# Altium project УШЯИ.467444.130.PrjPcb
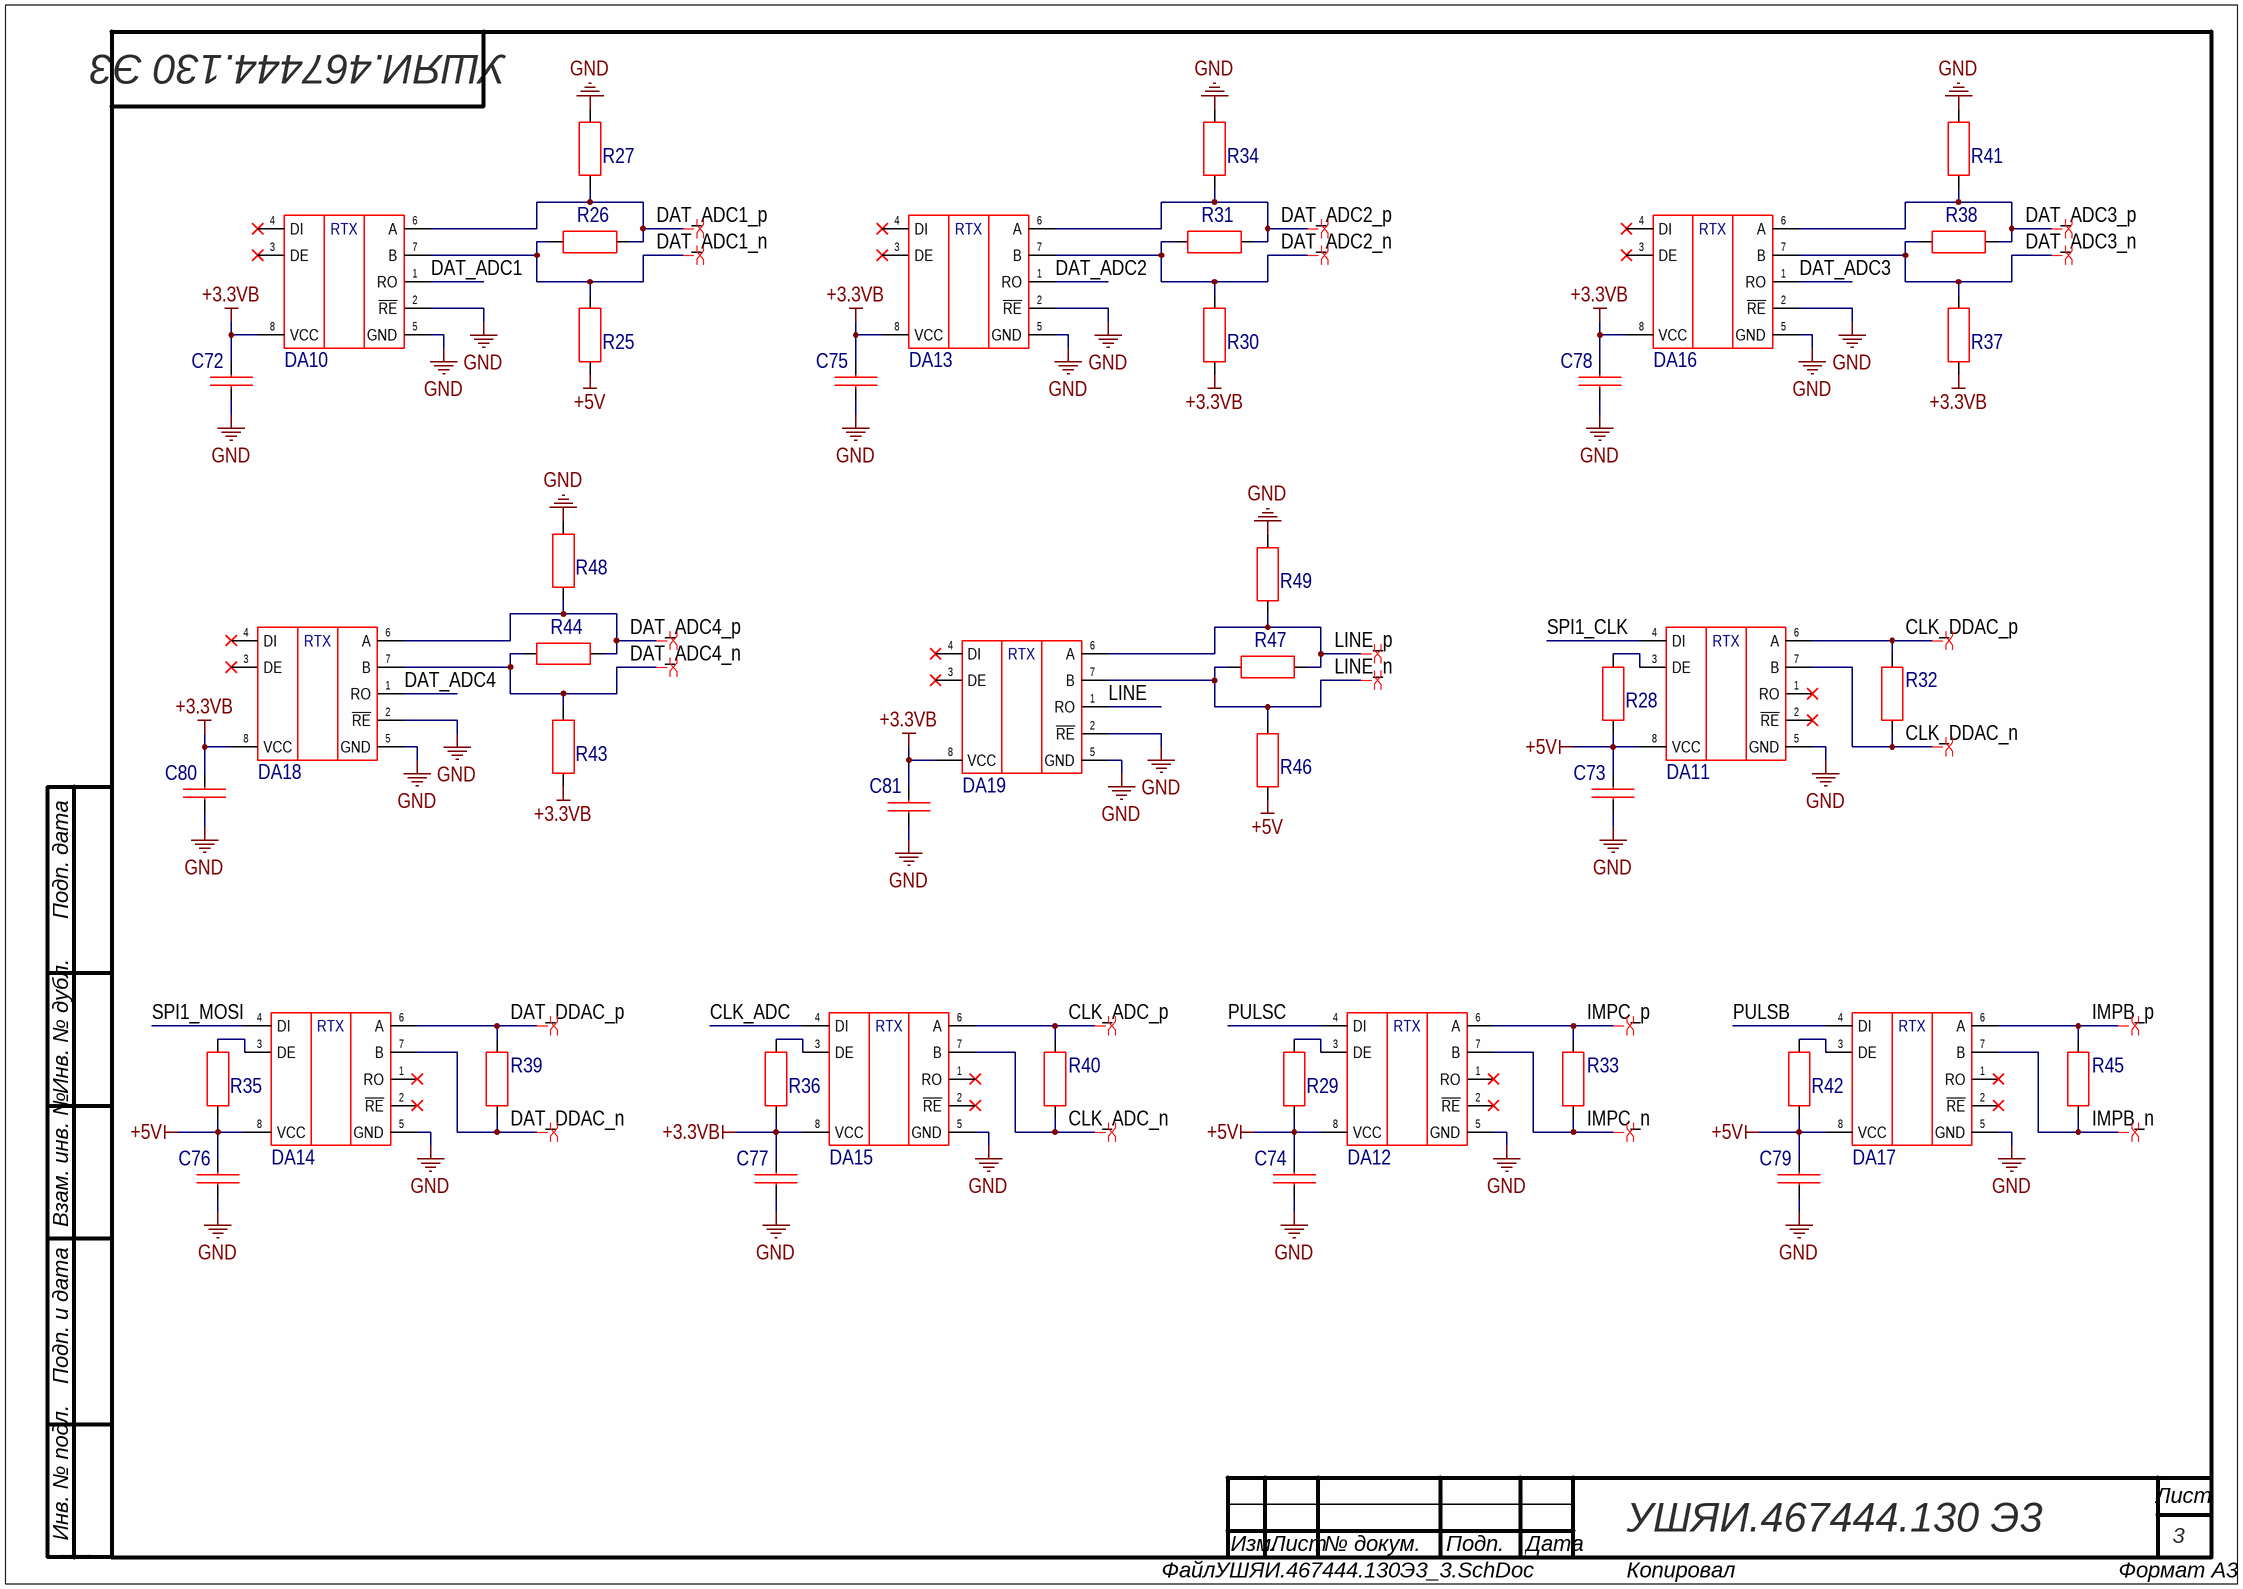
[diagram p0: УШЯИ.467444.130Э3_3.SchDoc]
Вид_документа_SCH: Схема электрическая принципиальная; Наименование2: Контроллер; Обозначение: УШЯИ.467444.130; Обозначение_Код: УШЯИ.467444.130 Э3; Перв.Примен.: УШЯИ.467444.130 Э3; ПервПримен: УШЯИ.467444.130 Э3; п_Разраб: Петрович; п_Разраб_Р: Петрович
1 sheet, 45 parts. Net scope: global (net labels, ports and power ports of the same name join across sheets).
Board file: УШЯИ.467444.130.PcbDoc

## Sheet УШЯИ.467444.130Э3_3.SchDoc
size 420 x 297 mm; SheetNumber: 3; SheetTotal: 5

### Parts
C72  0,1 µF  [C_0805 [2012 Metric]]  (value not drawn)
C73  0,1 µF  [C_0805 [2012 Metric]]  (value not drawn)
C74  0,1 µF  [C_0805 [2012 Metric]]  (value not drawn)
C75  0,1 µF  [C_0805 [2012 Metric]]  (value not drawn)
C76  0,1 µF  [C_0805 [2012 Metric]]  (value not drawn)
C77  0,1 µF  [C_0805 [2012 Metric]]  (value not drawn)
C78  0,1 µF  [C_0805 [2012 Metric]]  (value not drawn)
C79  0,1 µF  [C_0805 [2012 Metric]]  (value not drawn)
C80  0,1 µF  [C_0805 [2012 Metric]]  (value not drawn)
C81  0,1 µF  [C_0805 [2012 Metric]]  (value not drawn)
DA10  SN65HVD75D  [SOIC-8_1.27_5x4x1.75]  (value not drawn)
DA11  ADM483AR  [SOIC-8_1.27_5x4x1.75]  (value not drawn)
DA12  ADM483AR  [SOIC-8_1.27_5x4x1.75]  (value not drawn)
DA13  SN65HVD75D  [SOIC-8_1.27_5x4x1.75]  (value not drawn)
DA14  ADM483AR  [SOIC-8_1.27_5x4x1.75]  (value not drawn)
DA15  SN65HVD75D  [SOIC-8_1.27_5x4x1.75]  (value not drawn)
DA16  SN65HVD75D  [SOIC-8_1.27_5x4x1.75]  (value not drawn)
DA17  ADM483AR  [SOIC-8_1.27_5x4x1.75]  (value not drawn)
DA18  SN65HVD75D  [SOIC-8_1.27_5x4x1.75]  (value not drawn)
DA19  SN65HVD75D  [SOIC-8_1.27_5x4x1.75]  (value not drawn)
R25  1k  [R_1206 [3216 Metric]]  (value not drawn)
R26  100R  [R_0805 [2012 Metric]]  (value not drawn)
R27  1k  [R_1206 [3216 Metric]]  (value not drawn)
R28  10k  [R_0805 [2012 Metric]]  (value not drawn)
R29  10k  [R_0805 [2012 Metric]]  (value not drawn)
R30  100R  [R_0805 [2012 Metric]]  (value not drawn)
R31  100R  [R_0805 [2012 Metric]]  (value not drawn)
R32  100R  [R_0805 [2012 Metric]]  (value not drawn)
R33  100R  [R_0805 [2012 Metric]]  (value not drawn)
R34  1k  [R_1206 [3216 Metric]]  (value not drawn)
R35  10k  [R_0805 [2012 Metric]]  (value not drawn)
R36  10k  [R_0805 [2012 Metric]]  (value not drawn)
R37  1k  [R_1206 [3216 Metric]]  (value not drawn)
R38  100R  [R_0805 [2012 Metric]]  (value not drawn)
R39  100R  [R_0805 [2012 Metric]]  (value not drawn)
R40  100R  [R_0805 [2012 Metric]]  (value not drawn)
R41  1k  [R_1206 [3216 Metric]]  (value not drawn)
R42  10k  [R_0805 [2012 Metric]]  (value not drawn)
R43  1k  [R_1206 [3216 Metric]]  (value not drawn)
R44  100R  [R_0805 [2012 Metric]]  (value not drawn)
R45  100R  [R_0805 [2012 Metric]]  (value not drawn)
R46  1k  [R_1206 [3216 Metric]]  (value not drawn)
R47  100R  [R_0805 [2012 Metric]]  (value not drawn)
R48  1k  [R_1206 [3216 Metric]]  (value not drawn)
R49  1k  [R_1206 [3216 Metric]]  (value not drawn)

### Nets
+3.3VB: C72.2 C75.2 C77.2 C78.2 C80.2 C81.2 DA10.8(VCC) DA13.8(VCC) DA15.8(VCC) DA16.8(VCC) DA18.8(VCC) DA19.8(VCC) R30.1 R36.1 R37.1 R43.1
+5V: C73.2 C74.2 C76.2 C79.2 DA11.8(VCC) DA12.8(VCC) DA14.8(VCC) DA17.8(VCC) R25.1 R28.1 R29.1 R35.1 R42.1 R46.1
GND: C72.1 C73.1 C74.1 C75.1 C76.1 C77.1 C78.1 C79.1 C80.1 C81.1 DA10.2(~{RE}) DA10.5(GND) DA11.5(GND) DA12.5(GND) DA13.2(~{RE}) DA13.5(GND) DA14.5(GND) DA15.5(GND) DA16.2(~{RE}) DA16.5(GND) DA17.5(GND) DA18.2(~{RE}) DA18.5(GND) DA19.2(~{RE}) DA19.5(GND) R27.2 R34.2 R41.2 R48.2 R49.2
CLK_ADC: DA15.4(DI)
CLK_ADC_n: DA15.7(B) R40.1
CLK_ADC_p: DA15.6(A) R40.2
CLK_DDAC_n: DA11.7(B) R32.1
CLK_DDAC_p: DA11.6(A) R32.2
DAT_ADC1: DA10.1(RO)
DAT_ADC1_n: DA10.7(B) R25.2 R26.1
DAT_ADC1_p: DA10.6(A) R26.2 R27.1
DAT_ADC2: DA13.1(RO)
DAT_ADC2_n: DA13.7(B) R30.2 R31.1
DAT_ADC2_p: DA13.6(A) R31.2 R34.1
DAT_ADC3: DA16.1(RO)
DAT_ADC3_n: DA16.7(B) R37.2 R38.1
DAT_ADC3_p: DA16.6(A) R38.2 R41.1
DAT_ADC4: DA18.1(RO)
DAT_ADC4_n: DA18.7(B) R43.2 R44.1
DAT_ADC4_p: DA18.6(A) R44.2 R48.1
DAT_DDAC_n: DA14.7(B) R39.1
DAT_DDAC_p: DA14.6(A) R39.2
IMPB_n: DA17.7(B) R45.1
IMPB_p: DA17.6(A) R45.2
IMPC_n: DA12.7(B) R33.1
IMPC_p: DA12.6(A) R33.2
LINE: DA19.1(RO)
LINE_n: DA19.7(B) R46.2 R47.1
LINE_p: DA19.6(A) R47.2 R49.1
PULSB: DA17.4(DI)
PULSC: DA12.4(DI)
SPI1_CLK: DA11.4(DI)
SPI1_MOSI: DA14.4(DI)
NetDA11_3: DA11.3(DE) R28.2
NetDA12_3: DA12.3(DE) R29.2
NetDA14_3: DA14.3(DE) R35.2
NetDA15_3: DA15.3(DE) R36.2
NetDA17_3: DA17.3(DE) R42.2

Not connected (* = marked no-connect by the designer): DA10 3(DE)* 4(DI)*; DA11 1(RO)* 2(~{RE})*; DA12 1(RO)* 2(~{RE})*; DA13 3(DE)* 4(DI)*; DA14 1(RO)* 2(~{RE})*; DA15 1(RO)* 2(~{RE})*; DA16 3(DE)* 4(DI)*; DA17 1(RO)* 2(~{RE})*; DA18 3(DE)* 4(DI)*; DA19 3(DE)* 4(DI)*

### Layout directives
differential pair: CLK_ADC_n, CLK_ADC_p, CLK_DDAC_n, CLK_DDAC_p, DAT_ADC1_n, DAT_ADC1_p, DAT_ADC2_n, DAT_ADC2_p, DAT_ADC3_n, DAT_ADC3_p, DAT_ADC4_n, DAT_ADC4_p, DAT_DDAC_n, DAT_DDAC_p, IMPB_n, IMPB_p, IMPC_n, IMPC_p, LINE_n, LINE_p

### Notes on the sheet
- Подп. дата
- Инв. № дубл.
- Взам. инв. №
- Подп. и дата
- Инв. № подл.
- Изм.
- Лист
- № докум.
- Подп.
- Дата
- ALTIUM GOSTBOM2.0 KEV
- Файл:
- Копировал
- Формат А3
- (in symbol IC_11) RTX
- (in symbol IC_57) RTX

### Library data of the parts
C72-C81 = Cap_60: Неполярный конденсатор; Manufacturer: Murata; ID: Cap_60; Component Name: Конденсатор GRM21BR71H104KA01L; Voltage: 50V; Tolerance: ±10%; Datasheet: https://www.murata.com/en-eu/products/productdetail?partno=GRM21BR71H104KA01%23; Capacitance: 0,1 µF; Case / Package: 0805 [2012 Metric]; Height: 1.4mm; Weight, kg: 0,000006
  C72: ClassName: DA10
  C73: ClassName: DA11
  C74: ClassName: DA12
  C75: ClassName: DA13
  C76: ClassName: DA14
  C77: ClassName: DA15
  C78: ClassName: DA16
  C79: ClassName: DA17
  C80: ClassName: DA18
  C81: ClassName: DA19
DA10 DA13 DA15 DA16 DA18 DA19 = IC_57: IC, RS422 / RS485 Transceiver IC, 1 Driver, 1 Receiver, 3 V to 3.6 V, -40°C to 125°C, SOIC-8; Manufacturer: Texas Instruments; ID: IC_57; Component Name: Микросхема SN65HVD75D; Catalogue: ChipDip 8002953832; Device: SN65HVD75D; Datasheet: https://static.chipdip.ru/lib/276/DOC012276983.pdf; Case / Package: SOIC-8; Height: 1.75mm; Weight, kg: 0,002
  DA10: ClassName: DA10
  DA13: ClassName: DA13
  DA15: ClassName: DA15
  DA16: ClassName: DA16
  DA18: ClassName: DA18
  DA19: ClassName: DA19
DA11 DA12 DA14 DA17 = IC_11: IC, Transceiver, RS422/RS485, 1 Driver, 1 Receiver, 4.75 V to 5.25 V, -40°C to 125°C; Manufacturer: Analog Devices; ID: IC_11; Component Name: Микросхема ADM483AR; Device: ADM483AR; Datasheet: https://www.analog.com/media/en/technical-documentation/data-sheets/ADM383.pdf; Case / Package: SOIC-8; Height: 1.75mm; Weight, kg: 0,0002
  DA11: ClassName: DA11
  DA12: ClassName: DA12
  DA14: ClassName: DA14
  DA17: ClassName: DA17
R25 R27 R34 R37 R41 R43 R46 R48 R49 = Res_50: ID: Res_50; Component Name: Резистор 1206-1 кОм ±5%; Tolerance: ±5%; Resistance: 1k; Case / Package: 1206 [3216 Metric]; Height: 0.7mm; Weight, kg: 0,0000162
  R25 R27: ClassName: DA10
  R34: ClassName: DA13
  R37 R41: ClassName: DA16
  R43 R48: ClassName: DA18
  R46 R49: ClassName: DA19
R26 R30-R33 R38-R40 R44 R45 R47 = Res_10: ID: Res_10; Component Name: Резистор 0805-100 Ом ±5%; Tolerance: ±5%; Resistance: 100R; Case / Package: 0805 [2012 Metric]; Height: 0.7mm; Weight, kg: 0,000006
  R26: ClassName: DA10
  R30 R31: ClassName: DA13
  R32: ClassName: DA11
  R33: ClassName: DA12
  R38: ClassName: DA16
  R39: ClassName: DA14
  R40: ClassName: DA15
  R44: ClassName: DA18
  R45: ClassName: DA17
  R47: ClassName: DA19
R28 R29 R35 R36 R42 = Res_5: ID: Res_5; Component Name: Резистор 0805-10 кОм ±5%; Tolerance: ±5%; Resistance: 10k; Case / Package: 0805 [2012 Metric]; Height: 0.7mm; Weight, kg: 0,000006
  R28: ClassName: DA11
  R29: ClassName: DA12
  R35: ClassName: DA14
  R36: ClassName: DA15
  R42: ClassName: DA17